# EAGLE design boardweeny-adapter (EAGLE 5.10)
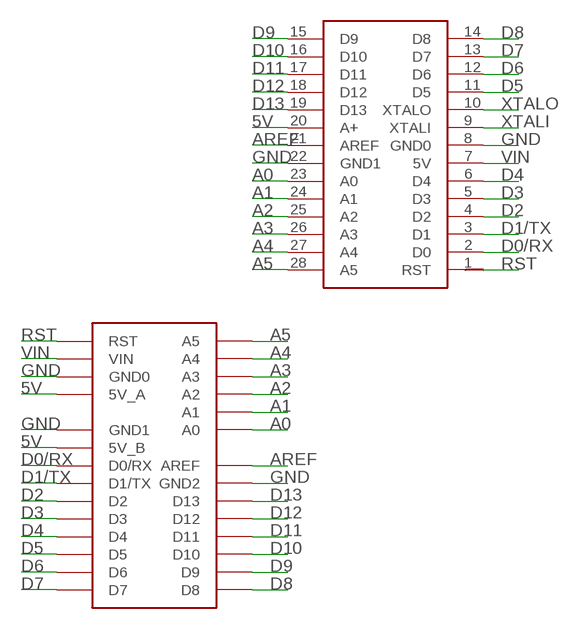
[diagram p0: schematic, sheet 1]

## Parts
U$1  BOARDUINO  [BOARDUINO]
U$2  ARDWEENY  [DIL28-3]

## Nets
5V: U$1.P$4(5V_A) U$1.P$6(5V_B) U$2.20(A+)
A0: U$1.P$23(A0) U$2.23(A0)
A1: U$1.P$24(A1) U$2.24(A1)
A2: U$1.P$25(A2) U$2.25(A2)
A3: U$1.P$26(A3) U$2.26(A3)
A4: U$1.P$27(A4) U$2.27(A4)
A5: U$1.P$28(A5) U$2.28(A5)
AREF: U$1.P$22(AREF) U$2.21(AREF)
D0/RX: U$1.P$7(D0/RX) U$2.2(D0)
D1/TX: U$1.P$8(D1/TX) U$2.3(D1)
D2: U$1.P$9(D2) U$2.4(D2)
D3: U$1.P$10(D3) U$2.5(D3)
D4: U$1.P$11(D4) U$2.6(D4)
D5: U$1.P$12(D5) U$2.11(D5)
D6: U$1.P$13(D6) U$2.12(D6)
D7: U$1.P$14(D7) U$2.13(D7)
D8: U$1.P$15(D8) U$2.14(D8)
D9: U$1.P$16(D9) U$2.15(D9)
D10: U$1.P$17(D10) U$2.16(D10)
D11: U$1.P$18(D11) U$2.17(D11)
D12: U$1.P$19(D12) U$2.18(D12)
D13: U$1.P$20(D13) U$2.19(D13)
GND: U$1.P$3(GND0) U$1.P$5(GND1) U$1.P$21(GND2) U$2.8(GND0) U$2.22(GND1)
RST: U$1.P$1(RST) U$2.1(RST)
VIN: U$1.P$2(VIN) U$2.7(5V)
XTALI: U$2.9(XTALI)
XTALO: U$2.10(XTALO)

## Library data of the parts
U$1 = ideabot:BOARDUINO
U$2 = ideabot:ARDWEENY

## Board
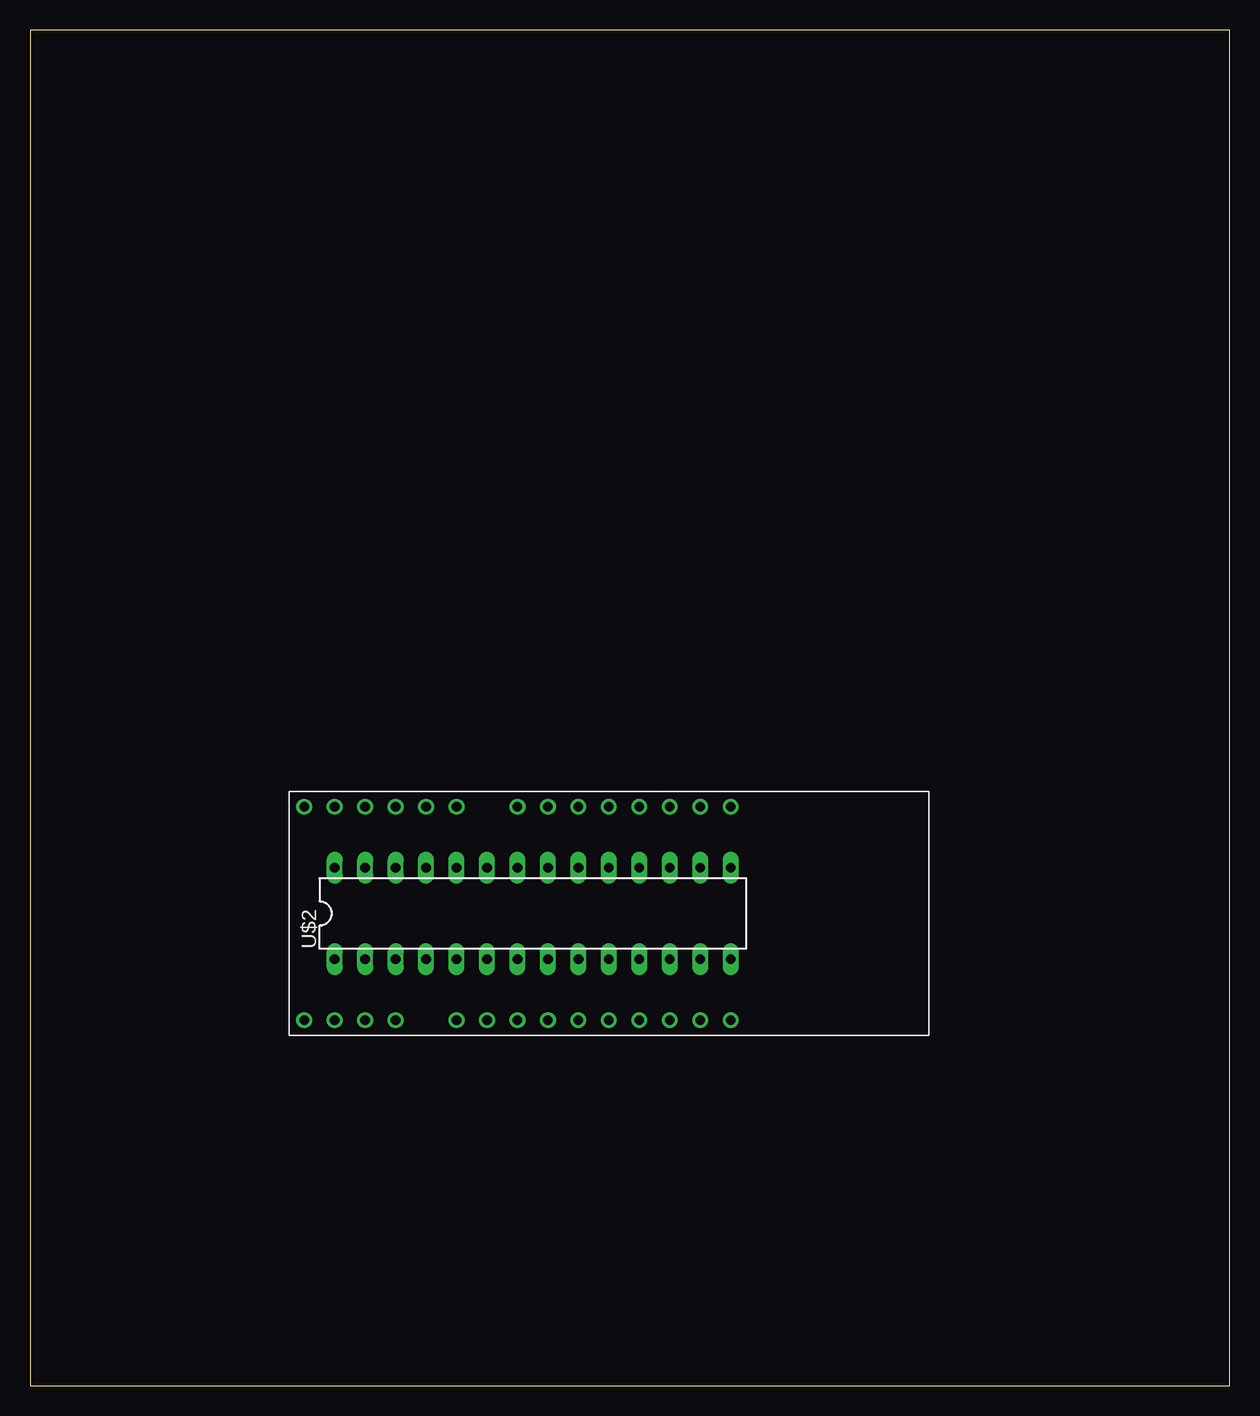
[diagram p1: board, top side]
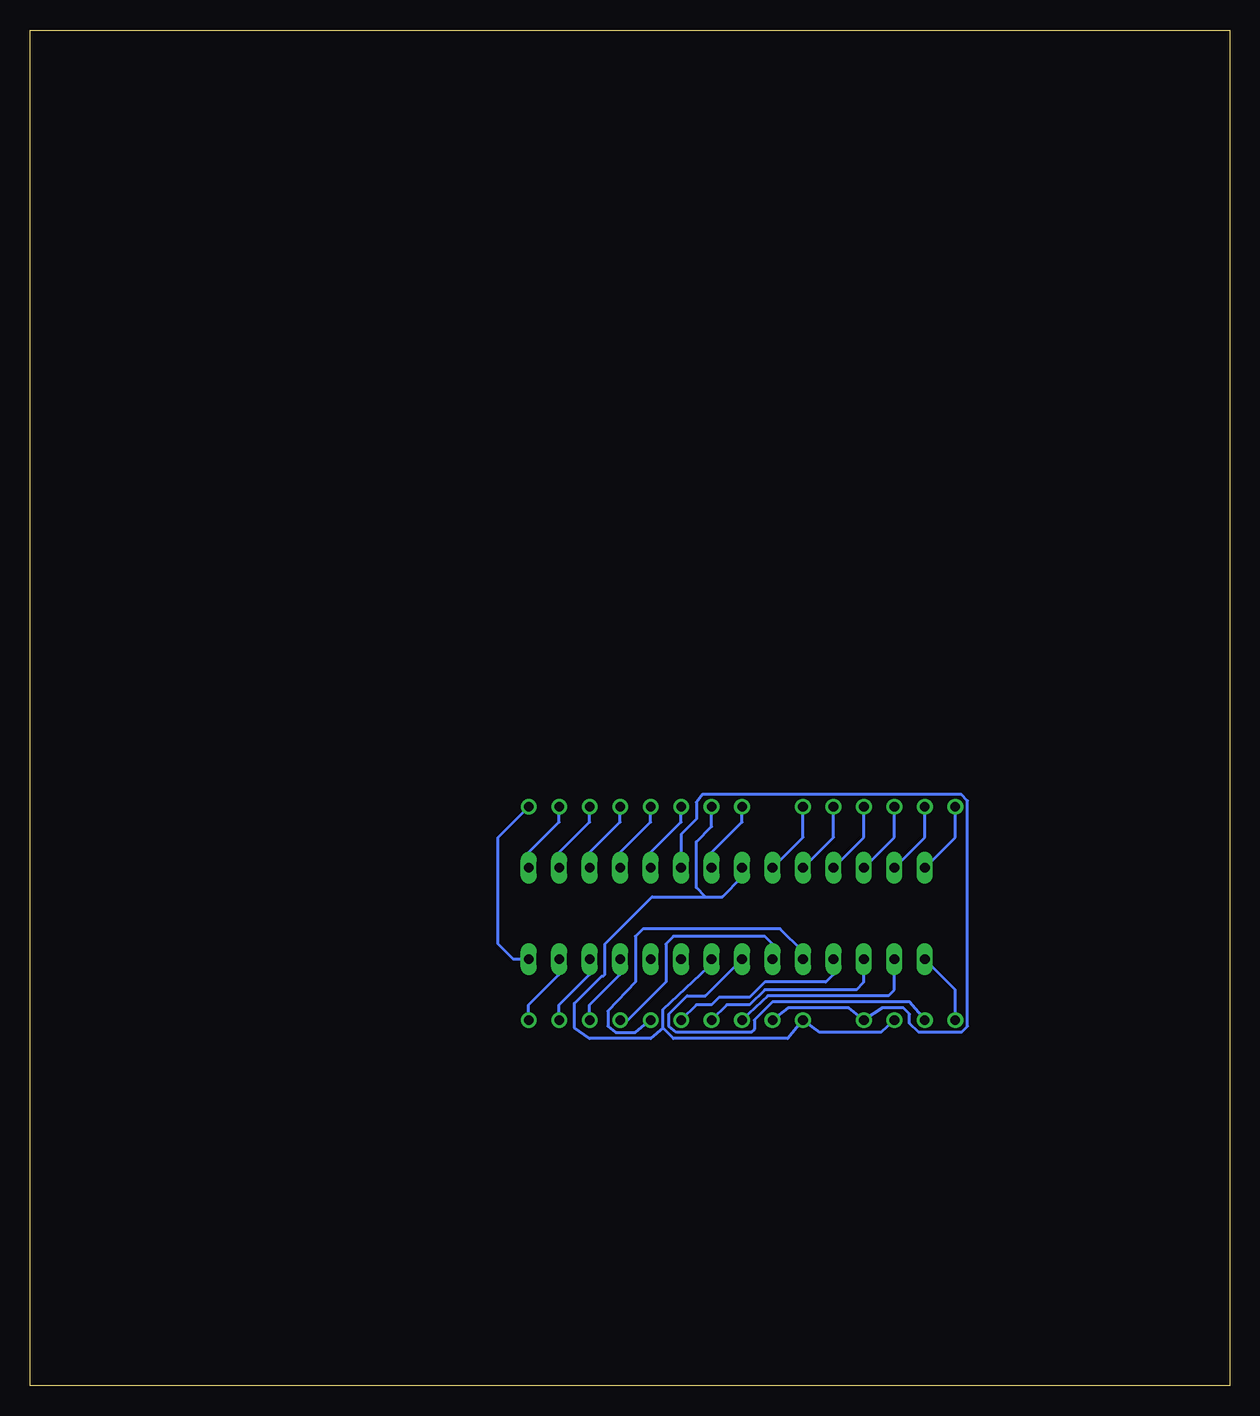
[diagram p2: board, bottom side, seen from below]

Size 100 x 113.02 mm. Coordinates in mm from the lower left corner, seen from the top.
Outline: 0,0 100,0 100,113.02 0,113.02 0,0
Copper layers (1*16): Top 0.035mm / dielectric 1.5mm / Bottom 0.035mm
Design rules "default": minimum track width 10mil, minimum drill 24mil, track to track 8mil, track to pad 8mil, pad to pad 8mil, via to via 8mil, smd to smd 8mil, copper to edge 40mil, drill to drill 8mil, minimum pad ring 10mil, minimum via ring 8mil, stop-mask expansion 4mil, vias tented up to drill 0mil, thermal gap 10mil

### Footprints (pad centres in the part's own frame; a part is rotated, then mirrored left to right if it is on the bottom)
BOARDUINO = drill 0.8 round: P$1 -17.78,-10.16; P$2 -15.24,-10.16; P$3 -12.7,-10.16; P$4 -10.16,-10.16; P$5 -5.08,-10.16; P$6 -2.54,-10.16; P$7 0,-10.16; P$8 2.54,-10.16; P$9 5.08,-10.16; P$10 7.62,-10.16; P$11 10.16,-10.16; P$12 12.7,-10.16; P$13 15.24,-10.16; P$14 17.78,-10.16; P$15 17.78,7.62; P$16 15.24,7.62; P$17 12.7,7.62; P$18 10.16,7.62; P$19 7.62,7.62; P$20 5.08,7.62; P$21 2.54,7.62; P$22 0,7.62; P$23 -5.08,7.62; P$24 -7.62,7.62; P$25 -10.16,7.62; P$26 -12.7,7.62; P$27 -15.24,7.62; P$28 -17.78,7.62
DIL28-3 = drill 0.813 long: 1 -16.51,-3.81; 2 -13.97,-3.81; 3 -11.43,-3.81; 4 -8.89,-3.81; 5 -6.35,-3.81; 6 -3.81,-3.81; 7 -1.27,-3.81; 8 1.27,-3.81; 9 3.81,-3.81; 10 6.35,-3.81; 11 8.89,-3.81; 12 11.43,-3.81; 13 13.97,-3.81; 14 16.51,-3.81; 15 16.51,3.81; 16 13.97,3.81; 17 11.43,3.81; 18 8.89,3.81; 19 6.35,3.81; 20 3.81,3.81; 21 1.27,3.81; 22 -1.27,3.81; 23 -3.81,3.81; 24 -6.35,3.81; 25 -8.89,3.81; 26 -11.43,3.81; 27 -13.97,3.81; 28 -16.51,3.81

### Placement (x,y rotation side)
U$1  40.64,40.64 0 top
U$2  41.91,39.37 0 top

### Tracks (layer width: path | path; a pad name or v marks a point on that pad's centre or on a via)
5V
  Bottom 0.254: U$1.P$6 36.83,31.5 31.75,31.5 U$1.P$4 28.96,31.5 27.18,31.5 26.67,30.99 26.67,30.23 25.91,29.46 22.35,29.46 21.84,29.97 21.84,48.77 22.35,49.28 43.94,49.28 44.45,48.64 44.45,47.24 45.72,45.97 U$2.20
A0
  Bottom 0.254: U$1.P$23 35.56,45.72 U$2.23
A1
  Bottom 0.254: U$1.P$24 33.02,45.72 U$2.24
A2
  Bottom 0.254: U$1.P$25 30.48,45.72 U$2.25
A3
  Bottom 0.254: U$1.P$26 27.94,45.72 U$2.26
A4
  Bottom 0.254: U$1.P$27 25.4,45.72 U$2.27
A5
  Bottom 0.254: U$1.P$28 22.86,45.72 U$2.28
AREF
  Bottom 0.254: U$1.P$22 40.64,46.99 43.18,44.45 U$2.21
D0/RX
  Bottom 0.254: U$2.2 27.94,33.02 28.45,32.51 38.48,32.51 U$1.P$7
D1/TX
  Bottom 0.254: U$2.3 30.48,33.66 31.11,33.02 38.73,33.02 40.01,31.75 41.91,31.75 U$1.P$8
D2
  Bottom 0.254: U$2.4 33.02,34.29 33.66,33.66 38.73,33.66 40.01,32.38 42.55,32.38 43.18,31.75 44.45,31.75 U$1.P$9
D3
  Bottom 0.254: U$1.P$10 49.53,29.46 51.18,29.46 51.82,29.97 51.82,31.24 49.53,33.66 49.53,37.47 48.9,38.1 37.47,38.1 35.56,36.2 U$2.5
D4
  Bottom 0.254: U$1.P$11 50.16,30.48 46.99,33.66 46.99,36.83 46.35,37.47 38.73,37.47 38.1,36.83 U$2.6
D5
  Bottom 0.254: U$1.P$12 53.34,31.75 50.8,34.29 U$2.11
D6
  Bottom 0.254: U$1.P$13 55.88,31.75 53.34,34.29 U$2.12
D7
  Bottom 0.254: U$1.P$14 58.42,31.75 55.88,34.29 U$2.13
D8
  Bottom 0.254: U$2.14 59.69,35.56 60.96,36.83 60.96,45.72 U$1.P$15
D9
  Bottom 0.254: U$2.15 58.42,44.45 55.88,46.99 U$1.P$16
D10
  Bottom 0.254: U$1.P$17 53.34,46.99 55.88,44.45 U$2.16
D11
  Bottom 0.254: U$1.P$18 50.8,46.99 53.34,44.45 U$2.17
D12
  Bottom 0.254: U$1.P$19 48.26,46.99 50.8,44.45 U$2.18
D13
  Bottom 0.254: U$1.P$20 45.72,46.99 48.26,44.45 U$2.19
GND
  Bottom 0.254: U$1.P$3 29.08,29.46 34.16,29.46 U$1.P$5 36.83,28.96 46.35,28.96 47.24,29.84 | U$2.8 43.43,34.92 47.24,31.37 47.24,29.84 | U$2.22 40.64,42.42 42.29,40.77 43.69,40.77 | 43.69,40.77 48.13,40.77 52.07,36.83 52.07,34.29 52.2,34.16 52.32,34.16 54.61,31.88 54.61,29.84 53.34,28.96 48.26,28.96 47.24,29.84 | U$1.P$21 43.18,46.61 44.45,45.34 44.45,41.53 43.69,40.77
RST
  Bottom 0.254: U$1.P$1 22.86,33.02 U$2.1
VIN
  Bottom 0.254: U$1.P$2 26.67,32 38.1,32 39.62,30.48 39.62,29.72 39.88,29.46 46.1,29.46 46.74,29.97 46.74,30.99 45.21,32.51 43.69,32.51 U$2.7